# Altium project 小板.PrjPcb
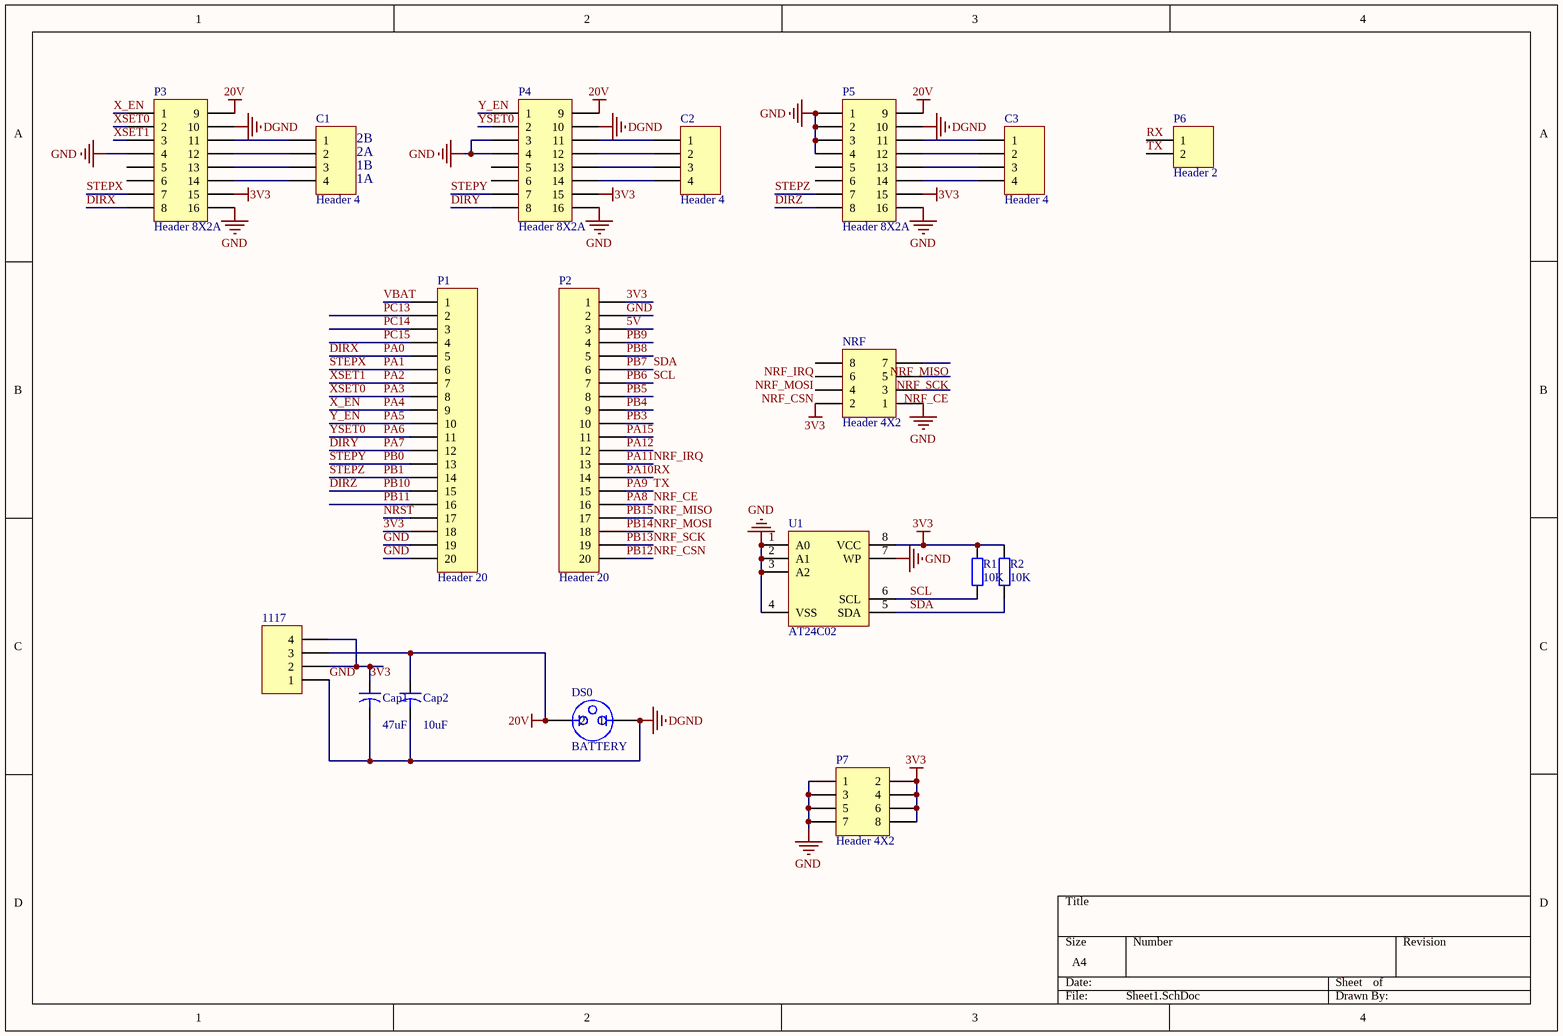
[diagram p0: Sheet1.SchDoc]
1 sheet, 18 parts. Net scope: global (net labels, ports and power ports of the same name join across sheets).
Board file: PCB1.PcbDoc

## Sheet Sheet1.SchDoc
size A4

### Parts
1117  Header 4  [SOT-223]  (value not drawn)
C1  Header 4  [HDR1X4]
C2  Header 4  [HDR1X4]
C3  Header 4  [HDR1X4]
Cap1  value 47uF  [CAPR5-4X5]  (hidden comment: Cap2)
Cap2  value 10uF  [CAPR5-4X5]  (hidden comment: Cap2)
DS0  BATTERY  [9V]
NRF  Header 4X2  [HDR2X4]
P1  Header 20  [HDR1X20]
P2  Header 20  [HDR1X20]
P3  Header 8X2A  [PCBComponent_1]
P4  Header 8X2A  [PCBComponent_1]
P5  Header 8X2A  [PCBComponent_1]
P6  Header 2  [HDR1X2]
P7  Header 4X2  [HDR2X4]
R1  value 10K  [R1/4]  (hidden comment: Res2)
R2  value 10K  [R1/4]  (hidden comment: Res2)
U1  AT24C02  [SOIC8P]

### Nets
3V3: 1117.2 1117.4 Cap1.1 NRF.2 P1.18 P2.1 P3.15 P4.15 P5.15 P7.2 P7.4 P7.6 P7.8 R1.2 R2.2 U1.8(VCC)
20V: 1117.3 Cap2.1 DS0.2 P3.9 P4.9 P5.9
GND: 1117.1 Cap1.2 Cap2.2 DS0.1 NRF.1 P1.19 P1.20 P2.2 P3.4 P3.10 P3.16 P4.3 P4.4 P4.10 P4.16 P5.1 P5.2 P5.3 P5.4 P5.10 P5.16 P7.1 P7.3 P7.5 P7.7 U1.1(A0) U1.2(A1) U1.3(A2) U1.4(VSS) U1.7(WP)  [also labelled DGND]
5V: P2.3
DIRX: P1.5 P3.8  [also labelled PA0]
DIRY: P1.12 P4.8  [also labelled PA7]
DIRZ: P1.15 P5.8  [also labelled PB10]
NRF_CE: NRF.3 P2.16  [also labelled PA8]
NRF_CSN: NRF.4 P2.20  [also labelled PB12]
NRF_IRQ: NRF.8 P2.13  [also labelled PA11]
NRF_MISO: NRF.7 P2.17  [also labelled PB15]
NRF_MOSI: NRF.6 P2.18  [also labelled PB14]
NRF_SCK: NRF.5 P2.19  [also labelled PB13]
NRST: P1.17
PA1: P1.6 P3.7  [also labelled STEPX]
PA2: P1.7 P3.3  [also labelled XSET1]
PA3: P1.8 P3.2  [also labelled XSET0]
PA4: P1.9 P3.1  [also labelled X_EN]
PA5: P1.10 P4.1  [also labelled Y_EN]
PA6: P1.11 P4.2  [also labelled YSET0]
PA9: P2.15 P6.2  [also labelled TX]
PA10: P2.14 P6.1  [also labelled RX]
PA12: P2.12
PA15: P2.11
PB0: P1.13 P4.7  [also labelled STEPY]
PB1: P1.14 P5.7  [also labelled STEPZ]
PB3: P2.10
PB4: P2.9
PB5: P2.8
PB6: P2.7 R1.1 U1.6(SCL)  [also labelled SCL]
PB7: P2.6 R2.1 U1.5(SDA)  [also labelled SDA]
PB8: P2.5
PB9: P2.4
PB11: P1.16
PC13: P1.2
PC14: P1.3
PC15: P1.4
VBAT: P1.1
NetC1_1: C1.1 P3.11
NetC1_2: C1.2 P3.12
NetC1_3: C1.3 P3.13
NetC1_4: C1.4 P3.14
NetC2_1: C2.1 P4.11
NetC2_2: C2.2 P4.12
NetC2_3: C2.3 P4.13
NetC2_4: C2.4 P4.14
NetC3_1: C3.1 P5.11
NetC3_2: C3.2 P5.12
NetC3_3: C3.3 P5.13
NetC3_4: C3.4 P5.14

Not connected (* = marked no-connect by the designer): P3 5 6; P4 5 6; P5 5 6

### Notes on the sheet
- (near C1) 2B
- (near C1) 2A
- (near C1) 1B
- (near C1) 1A

### Library data of the parts
1117 C1-C3 = Header 4: Header, 4-Pin; LatestRevisionDate: 17-Jul-2002; LatestRevisionNote: Re-released for DXP Platform.; Publisher: Altium Limited
Cap1 Cap2 = Cap2: Capacitor; Published: 23-Sep-2002; PackageReference: CAPR5-4X5; Publisher: Altium Limited; PackageDescription: Capacitor; 2 Leads
NRF P7 = Header 4X2: Header, 4-Pin, Dual row; LatestRevisionDate: 17-Jul-2002; LatestRevisionNote: Re-released for DXP Platform.; Publisher: Altium Limited
P1 P2 = Header 20: Header, 20-Pin; LatestRevisionDate: 17-Jul-2002; LatestRevisionNote: Re-released for DXP Platform.; Publisher: Altium Limited
P3-P5 = Header 8X2A: Header, 8-Pin, Dual row; LatestRevisionDate: 17-Jul-2002; LatestRevisionNote: Re-released for DXP Platform.; Publisher: Altium Limited
P6 = Header 2: Header, 2-Pin; LatestRevisionDate: 17-Jul-2002; LatestRevisionNote: Re-released for DXP Platform.; Publisher: Altium Limited
R1 R2 = Res2: Resistor; Published: 8-Jun-2000; LatestRevisionDate: 17-Jul-2002; LatestRevisionNote: Re-released for DXP Platform.; PackageReference: AXIAL-0.4; Publisher: Altium Limited; PackageDescription: Axial Device, Thru-Hole; 2 Leads; 0.4 in Pin Spacing
U1 = AT24C02: EEROM存储器